# Altium schematic sheet top.SchDoc
size A4; SheetNumber: 1; SheetTotal: 1
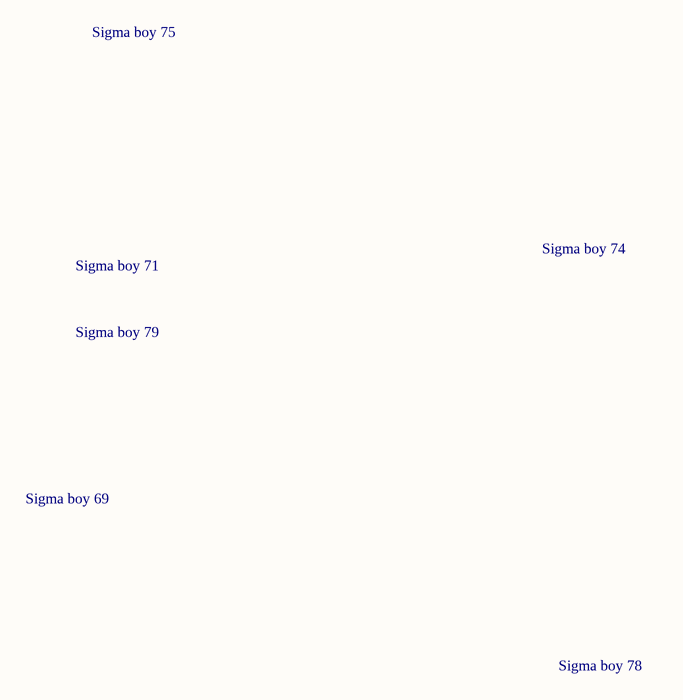
[diagram p0: top.SchDoc]

## Notes on the sheet
- Sigma boy 75
- Sigma boy 71
- Sigma boy 74
- Sigma boy 79
- Sigma boy 69
- Sigma boy 78